# Altium schematic sheet Power.SchDoc
size B; CompanyName: Microchip Technology Inc.; Organization: Microchip Technology; Address1: 2355 West Chandler Blvd.; Address2: Chandler, AZ  85224; Address4: USA; SheetNumber: 3; SheetTotal: 4; SheetTitle: **; Time: Time
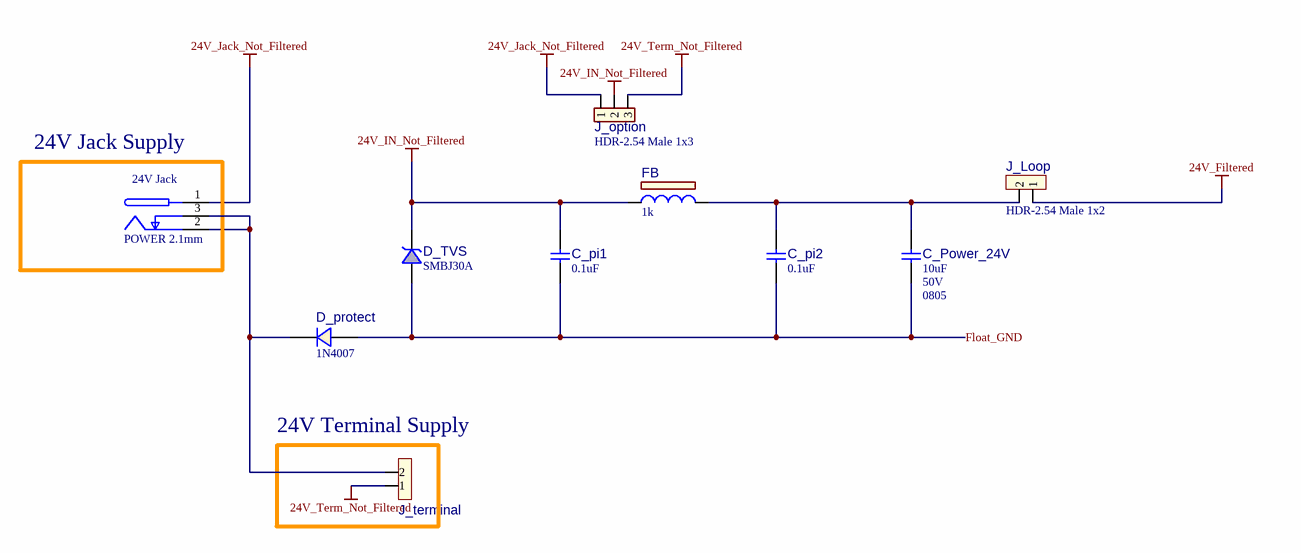
[diagram p0: Power.SchDoc]

## Parts
24V_Jack  value POWER 2.1mm  [CON_JACK_POWER_TH_RA_WE_694106301002]  (hidden comment: CON JACK 2C 3P SPST)
C_pi1  value 0.1uF  [CAP_C_0603]  (hidden comment: Capacitor NP)
C_pi2  value 0.1uF  [CAP_C_0603]  (hidden comment: Capacitor NP)
C_Power_24V  value 10uF  Voltage: 50V  Package: 0805  [CAP_C_0805]  (hidden comment: Capacitor NP)
D_protect  value 1N4007  [DO-41]  (hidden comment: Diode Single)
D_TVS  value SMBJ30A  [DO-214AA_SMB]  (hidden comment: Diode TVS Unidirectional)
FB  value 1k  [IND_C_0603]  (hidden comment: Ferrite Bead)
J_Loop  value HDR-2.54 Male 1x2  [HDR_M_2.54_1x2]  (hidden comment: Header 1x2)
J_option  value HDR-2.54 Male 1x3  [HDR_M_2.54_1x3]
J_terminal  (no value)  [CON_TERMINAL_3.81_1x2_TH_RA_PHO_1727010]

## Nets
24V_Filtered: J_Loop.1
24V_IN_Not_Filtered: C_pi1.2 D_TVS.2 FB.1 J_option.2
24V_Jack_Not_Filtered: 24V_Jack.1(PLUS) J_option.1
24V_Term_Not_Filtered: J_option.3 J_terminal.1
Float_GND: C_pi1.1 C_pi2.1 C_Power_24V.1 D_protect.1(A) D_TVS.1
Net24V_Jack_2: 24V_Jack.2(COM) 24V_Jack.3(SWITCH) D_protect.2(K) J_terminal.2
NetC_pi2_2: C_pi2.2 C_Power_24V.2 FB.2 J_Loop.2

## Notes on the sheet
- (near 24V_Jack) 24V Jack Supply
- (near J_terminal) 24V Terminal Supply
- Project Owner:
- PCB Layout Contact:
- PartNumber:
- Project Title
- Variant:
- Sheet Title
- Size
- B
- SCH #:
- PCB #:
- Rev:
- Date:
- Sheet
- Designed with
- Altium.com <http://go.altium.com/MicrochipLandingPage_Evaluation.html>
- File:

## Library data of the parts
24V_Jack = CON2146: Manufacturer Part Number 1: 694106301002; Manufacturer 1: Wuerth Elektronik; Description_: CON POWER 2.1mm 5.5mm SWITCH TH R/A; Populated: YES; Dev Tools Status: Production; Owner: Narasimha Murthy; Voltage: 24V; Current: 5A; Restricted Sourcing: No; Type: Power; Supplier 1: Digi-Key; Supplier Part Number 1: 732-5930-ND; ComponentLink1Description: SVN Datasheet; ComponentLink1URL: https://chn-vm-apps.microchip.com/mchprepo/parts/Datasheets/6941xx301002.pdf; Status: MCL Design; MCHP-ID: CON2146; Quantity Override: 1; Revision: 2; Symbol: CON JACK 2C 3P SPST; ComponentLink2URL: C:\ALTIUM_WORK\00001_MCHP-CDB\Datasheets\6941xx301002.pdf; ComponentLink2Description: Local Datasheet; ComponentLink3URL: C:\ALTIUM_WORK\00001_MCHP-CDB\Library\LibraryRefs\CON JACK 2C 3P SPST.SchLib; ComponentLink3Description: Open Symbol; ComponentLink4URL: C:\ALTIUM_WORK\00001_MCHP-CDB\Library\Footprints\CON_JACK_POWER_TH_RA_WE_694106301002.PcbLib; ComponentLink4Description: Open Footprint; ComponentLink5Description: Open Footprint 2; ComponentLink6Description: Open Footprint 3; ComponentLink7Description: Open Footprint 4; Category: Connector; Operating Temperature: -40C to 85C; Assembly Type: TH
C_pi1 C_pi2 = CAP1047: Manufacturer 1: Samsung Electro-Mechanics; Manufacturer Part Number 1: CL10B104MB8NNNC; Voltage: 50V; Description_: CAP CER 0.1uF 50V 20% X7R SMD 0603; Dev Tools Status: Production; Tolerance: 20%; Owner: Leah Whitaker; Populated: Yes; Temperature Coefficient: X7R; Restricted Sourcing: No; MCHP-ID: CAP1047; Package: 0603; Revision: 3; Symbol: Capacitor NP; Status: MCL Design; ComponentLink1URL: https://chn-vm-apps.microchip.com/mchprepo/parts/Datasheets/general_B11.pdf; ComponentLink1Description: SVN Datasheet; ComponentLink2URL: C:\ALTIUM_WORK\00001_MCHP-CDB\Datasheets\general_B11.pdf; ComponentLink2Description: Local Datasheet; ComponentLink3URL: C:\ALTIUM_WORK\00001_MCHP-CDB\Library\LibraryRefs\Capacitor NP.SchLib; ComponentLink3Description: Open Symbol; ComponentLink4URL: C:\ALTIUM_WORK\00001_MCHP-CDB\Library\Footprints\CAP_C_0603.PcbLib; ComponentLink4Description: Open Footprint; ComponentLink5Description: Open Footprint 2; ComponentLink6Description: Open Footprint 3; ComponentLink7Description: Open Footprint 4; Operating Temperature: -55C to +125C; Type: Ceramic; Category: Capacitor; Manufacturer 2: TDK Corporation; Manufacturer Part Number 2: C1608X7R1H104M080AA; Supplier 1: Digi-Key; Supplier Part Number 1: 1276-1941-2-ND; Supplier 2: Digi-Key; Supplier Part Number 2: 445-5098-1-ND; Quantity Override: 1
C_Power_24V = CAP2936: Manufacturer 1: Murata; Manufacturer Part Number 1: GRM21BR61H106KE43L; Description_: CAP CER 10uF 50V 10% X5R SMD 0805; Dev Tools Status: Production; Tolerance: 10%; Temperature Coefficient: X5R; Owner: Sam Charles; Populated: YES; Restricted Sourcing: No; MCHP-ID: CAP2936; Revision: 1; Symbol: Capacitor NP; Status: MCL Design; ComponentLink1URL: https://chn-vm-apps.microchip.com/mchprepo/parts/Datasheets/GRM21BR61H106KE43-01A.pdf; ComponentLink1Description: SVN Datasheet; ComponentLink2URL: C:\ALTIUM_WORK\00001_MCHP-CDB\Datasheets\GRM21BR61H106KE43-01A.pdf; ComponentLink2Description: Local Datasheet; ComponentLink3URL: C:\ALTIUM_WORK\00001_MCHP-CDB\Library\LibraryRefs\Capacitor NP.SchLib; ComponentLink3Description: Open Symbol; ComponentLink4URL: C:\ALTIUM_WORK\00001_MCHP-CDB\Library\Footprints\CAP_C_0805.PcbLib; ComponentLink4Description: Open Footprint; ComponentLink5Description: Open Footprint 2; ComponentLink6Description: Open Footprint 3; ComponentLink7Description: Open Footprint 4; Operating Temperature: -55°C ~ 85°C; Type: Ceramic; Category: Capacitor; Supplier 1: Digi-Key; Supplier Part Number 1: 490-18663-1-ND; Quantity Override: 1
D_protect = DIODE0118: Manufacturer 1: Micro Commercial Components Corporation; Manufacturer Part Number 1: 1N4007-T; Description_: DIO RECT 1N4007 1V 1A 1000V DO-41; Dev Tools Status: Production; Forward Current: 1A; Reverse Current: 5uA; Reverse Voltage: 1000V; Populated: Yes; Restricted Sourcing: No; MCHP-ID: DIODE0118; Revision: 2; Symbol: Diode Single; Status: MCL Design; Package: DO-41; ComponentLink1URL: https://chn-vm-apps.microchip.com/mchprepo/parts/Datasheets/1N4001-1N4007_DO-41_.pdf; ComponentLink1Description: SVN Datasheet; ComponentLink2URL: C:\ALTIUM_WORK\00001_MCHP-CDB\Datasheets\1N4001-1N4007_DO-41_.pdf; ComponentLink2Description: Local Datasheet; ComponentLink3URL: C:\ALTIUM_WORK\00001_MCHP-CDB\Library\LibraryRefs\Diode Single.SchLib; ComponentLink3Description: Open Symbol; ComponentLink4URL: C:\ALTIUM_WORK\00001_MCHP-CDB\Library\Footprints\DO-41.PcbLib; ComponentLink4Description: Open Footprint; ComponentLink5Description: Open Footprint 2; ComponentLink6Description: Open Footprint 3; ComponentLink7Description: Open Footprint 4; Operating Temperature: -55C to +150C; Category: Diode; Type: Rectifier Single; Manufacturer 2: Yangzhou Yangjie Electronic Technology Co., Ltd.; Manufacturer Part Number 2: 1N4007; Supplier 1: Digi-Key; Supplier Part Number 1: 1N4007-TPMSCT-ND; Supplier 2: Yangzhou Yangjie Electronic Technology Co., Ltd.; Supplier Part Number 2: 1N4007; Quantity Override: 1
D_TVS = DIODE1321: Manufacturer 1: Vishay; Manufacturer Part Number 1: SMBJ30A-E3/52; Description_: DIODE TVS SMBJ30A-E3/52 30V 600W SMD DO-214AA_SMB; Dev Tools Status: Design; Power: 600W; Reverse Voltage: 30V; Owner: Mark Loper; Populated: YES; Restricted Sourcing: No; MCHP-ID: DIODE1321; Revision: 1; Symbol: Diode TVS Unidirectional; Status: MCL Design; Package: DO-214AA; ComponentLink1URL: https://chn-vm-apps.microchip.com/mchprepo/parts/Datasheets/smbj50a.pdf; ComponentLink1Description: SVN Datasheet; ComponentLink2URL: C:\ALTIUM_WORK\00001_MCHP-CDB\Datasheets\smbj50a.pdf; ComponentLink2Description: Local Datasheet; ComponentLink3URL: C:\ALTIUM_WORK\00001_MCHP-CDB\Library\LibraryRefs\Diode TVS Unidirectional.SchLib; ComponentLink3Description: Open Symbol; ComponentLink4URL: C:\ALTIUM_WORK\00001_MCHP-CDB\Library\Footprints\DO-214AA_SMB.PcbLib; ComponentLink4Description: Open Footprint; ComponentLink5Description: Open Footprint 2; ComponentLink6Description: Open Footprint 3; ComponentLink7Description: Open Footprint 4; Category: Diode; Type: TVS; Supplier 1: Digi-Key; Supplier Part Number 1: SMBJ30A-E3/52GICT-ND; Quantity Override: 1
FB = FB1008: Manufacturer 1: Bourns Inc; Manufacturer Part Number 1: MZ1608-102Y; MCHP-ID: FB1008; Description_: FERRITE 1k@100MHz 100mA SMD 0603; Dev Tools Status: Design; Owner: Jojie Batislaon; DCR: 0.6R; Saturation Current: 100mA; Test Frequency: 100MHz; Populated: YES; Restricted Sourcing: No; Revision: A; Symbol: Ferrite Bead; Status: MCL Design; ComponentLink1URL: https://chn-vm-apps.microchip.com/mchprepo/parts/Datasheets/mgmumz.pdf; ComponentLink1Description: SVN Datasheet; ComponentLink2URL: C:\ALTIUM_WORK\00001_MCHP-CDB\Datasheets\mgmumz.pdf; ComponentLink2Description: Local Datasheet; ComponentLink3URL: C:\ALTIUM_WORK\00001_MCHP-CDB\Library\LibraryRefs\Ferrite Bead.SchLib; ComponentLink3Description: Open Symbol; ComponentLink4URL: C:\ALTIUM_WORK\00001_MCHP-CDB\Library\Footprints\IND_C_0603.PcbLib; ComponentLink4Description: Open Footprint; ComponentLink5Description: Open Footprint 2; ComponentLink6Description: Open Footprint 3; ComponentLink7Description: Open Footprint 4; Operating Temperature: -55C to +125C; Package: 0603; Type: Ferrite Bead; Category: Inductor; Supplier 1: Digi-Key; Supplier Part Number 1: MZ1608-102YCT-ND; Quantity Override: 1
J_Loop = CON1632: Manufacturer 1: Wuerth Elektronik; Manufacturer Part Number 1: 61300211121; Description_: CON HDR-2.54 Male 1x2 Gold 5.84MH TH VERT; Dev Tools Status: Production; Owner: Narasimha Murthy; Voltage: 250V; Current: 3A; Populated: YES; MCHP-ID: CON1632; Revision: 5; Symbol: Header 1x2; Status: MCL Design; ComponentLink1URL: https://chn-vm-apps.microchip.com/mchprepo/parts/Datasheets/6130xx11121.pdf; ComponentLink1Description: SVN Datasheet; ComponentLink2URL: C:\ALTIUM_WORK\00001_MCHP-CDB\Datasheets\6130xx11121.pdf; ComponentLink2Description: Local Datasheet; ComponentLink3URL: C:\ALTIUM_WORK\00001_MCHP-CDB\Library\LibraryRefs\Header 1x2.SchLib; ComponentLink3Description: Open Symbol; ComponentLink4URL: C:\ALTIUM_WORK\00001_MCHP-CDB\Library\Footprints\HDR_M_2.54_1x2.PcbLib; ComponentLink4Description: Open Footprint; ComponentLink5Description: Open Footprint 2; ComponentLink6Description: Open Footprint 3; ComponentLink7Description: Open Footprint 4; Type: Header 2.54mm; Category: Connector; Manufacturer 2: Shanghai NS-TECH; Manufacturer Part Number 2: NS-201-SH0385-201S-1*2P(F); Supplier 1: Digi-Key; Supplier Part Number 1: 732-5315-ND; Supplier 2: Shanghai NS-TECH; Supplier Part Number 2: NS-201-SH0385-201S-1*2P(F); Quantity Override: 1; Assembly Type: TH; Restricted Sourcing: Yes
J_option = CON1105: Manufacturer 1: Amphenol ICC (FCI); Manufacturer Part Number 1: 68000-103HLF; Description_: CON HDR-2.54 Male 1x3 Gold 5.84MH TH VERT; Dev Tools Status: Production; Owner: Bogdan P (M91398); Populated: Yes; Restricted Sourcing: No; MCHP-ID: CON1105; Revision: 6; Symbol: Header 1x3; Status: MCL Design; ComponentLink1URL: https://chn-vm-apps.microchip.com/mchprepo/parts/Datasheets/68000.pdf; ComponentLink1Description: SVN Datasheet; ComponentLink2URL: C:\ALTIUM_WORK\00001_MCHP-CDB\Datasheets\68000.pdf; ComponentLink2Description: Local Datasheet; ComponentLink3URL: C:\ALTIUM_WORK\00001_MCHP-CDB\Library\LibraryRefs\Header 1x3.SchLib; ComponentLink3Description: Open Symbol; ComponentLink4URL: C:\ALTIUM_WORK\00001_MCHP-CDB\Library\Footprints\HDR_M_2.54_1x3.PcbLib; ComponentLink4Description: Open Footprint; ComponentLink5Description: Open Footprint 2; ComponentLink6Description: Open Footprint 3; ComponentLink7Description: Open Footprint 4; Type: Header 2.54mm; Category: Connector; Manufacturer 2: Samtec; Manufacturer Part Number 2: TSW-103-07-G-S; Supplier 1: Digi-Key; Supplier Part Number 1: 609-3461-ND; Supplier 2: Digi-Key; Supplier Part Number 2: SAM1029-03-ND; Quantity Override: 1; Manufacturer 3: SHENZHEN JUNHAO ENGINEERING; Manufacturer Part Number 3: R-211-0311-0021-000; Manufacturer 4: Shanghai NS-TECH; Manufacturer Part Number 4: NS-201-SH0100-1*3; Supplier 3: SHENZHEN JUNHAO ENGINEERING; Supplier Part Number 3: R-211-0311-0021-000; Supplier 4: Shanghai NS-TECH; Supplier Part Number 4: NS-201-SH0100-1*3
J_terminal = CON2378: Manufacturer 1: Phoenix Contact; Manufacturer Part Number 1: 1727010; Value: TERMINAL 1x2; Description_: CON TERMINAL 3.81mm 1x2 Female 16-30AWG 13.5A TH R/A; Dev Tools Status: Design; Owner: Kamatchi Sundaresan; Voltage: 300V; Current: 13.5A; Populated: YES; MCHP-ID: CON2378; Revision: A; Symbol: Header 1x2; Status: MCL Design; ComponentLink1URL: https://chn-vm-apps.microchip.com/mchprepo/parts/Datasheets/1727010.pdf; ComponentLink1Description: SVN Datasheet; ComponentLink2URL: C:\ALTIUM_WORK\00001_MCHP-CDB\Datasheets\1727010.pdf; ComponentLink2Description: Local Datasheet; ComponentLink3URL: C:\ALTIUM_WORK\00001_MCHP-CDB\Library\LibraryRefs\Header 1x2.SchLib; ComponentLink3Description: Open Symbol; ComponentLink4URL: C:\ALTIUM_WORK\00001_MCHP-CDB\Library\Footprints\CON_TERMINAL_3.81_1x2_TH_RA_PHO_1727010.PcbLib; ComponentLink4Description: Open Footprint; ComponentLink5Description: Open Footprint 2; ComponentLink6Description: Open Footprint 3; ComponentLink7Description: Open Footprint 4; Type: Terminal Block; Category: Connector; Supplier 1: Digi-Key; Supplier Part Number 1: 277-1947-ND; Quantity Override: 1; Assembly Type: TH